# Altium project converter1.PrjPcb
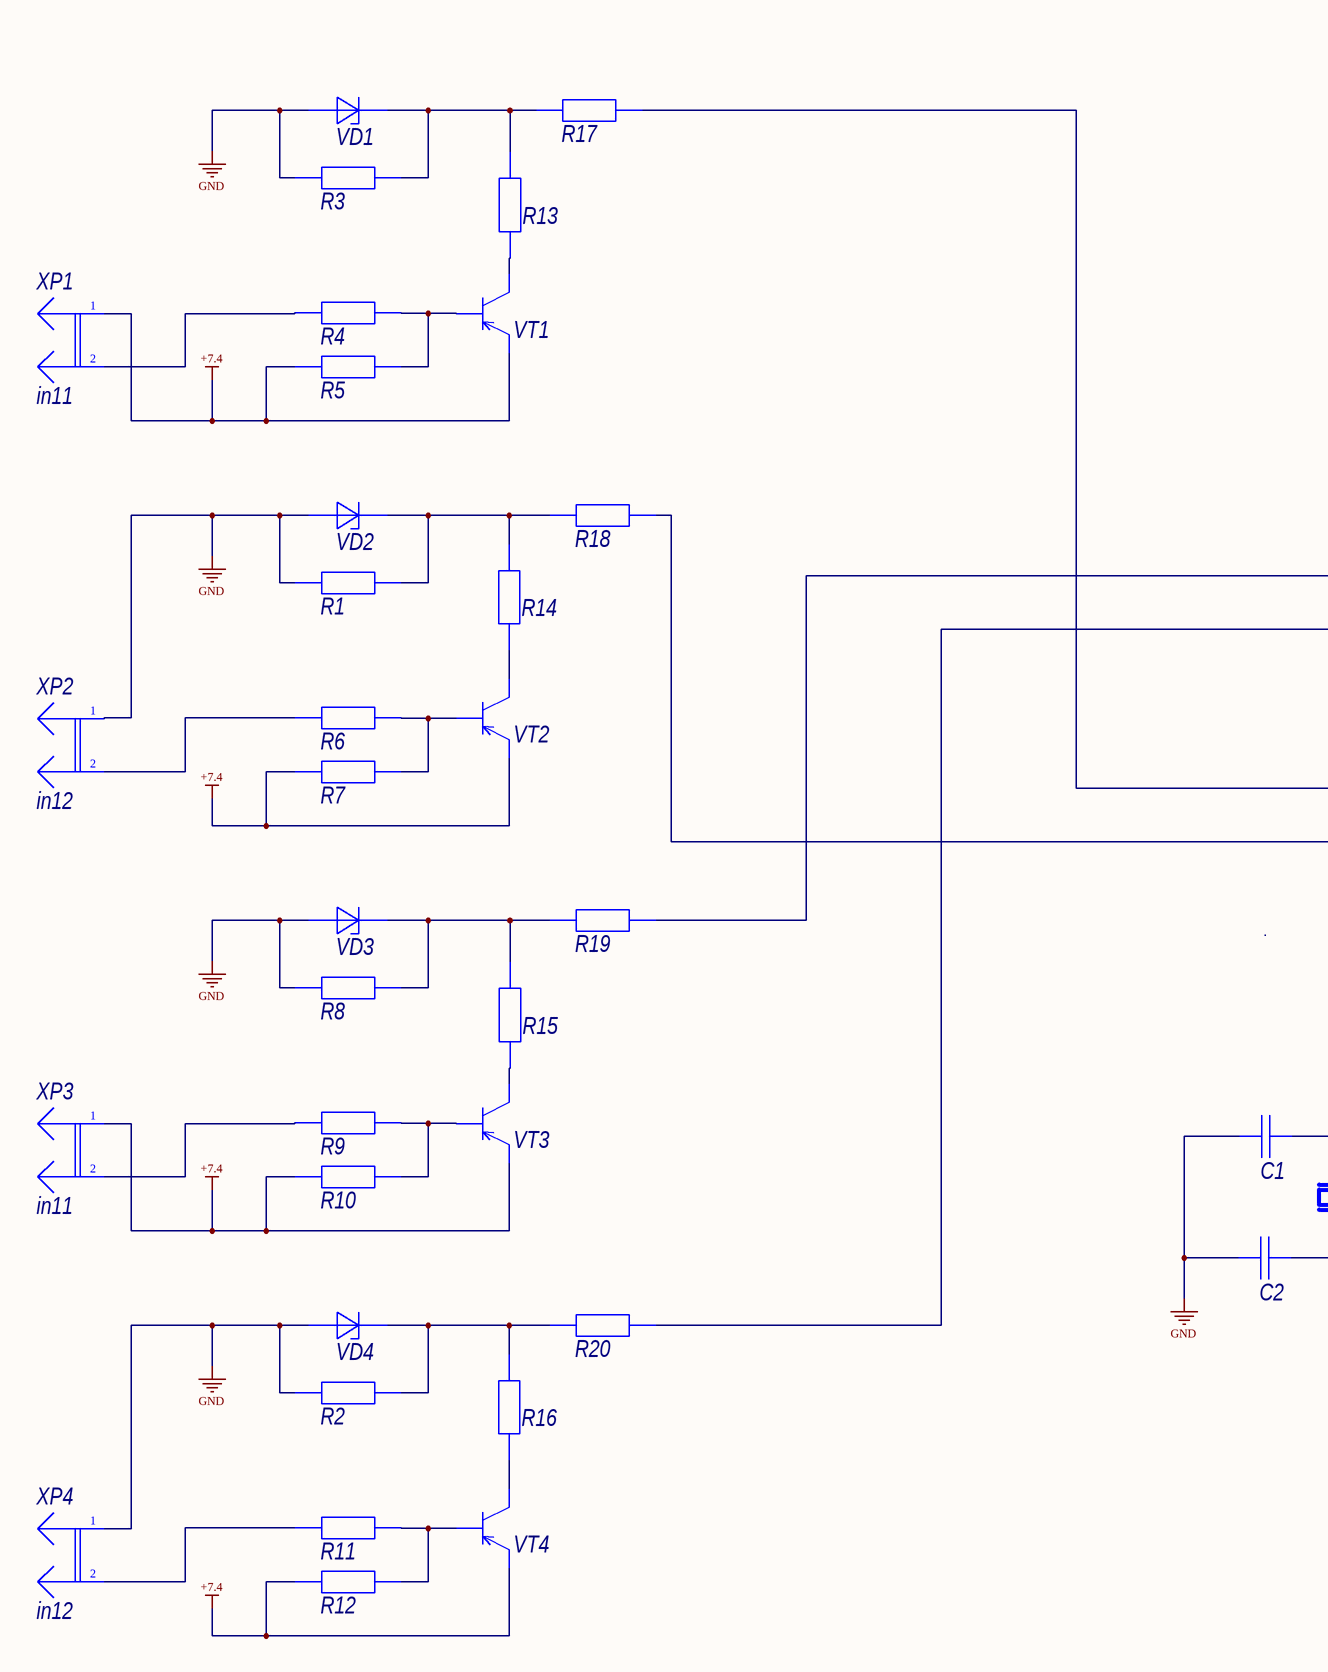
[diagram p0: Sheet1.SchDoc, left]
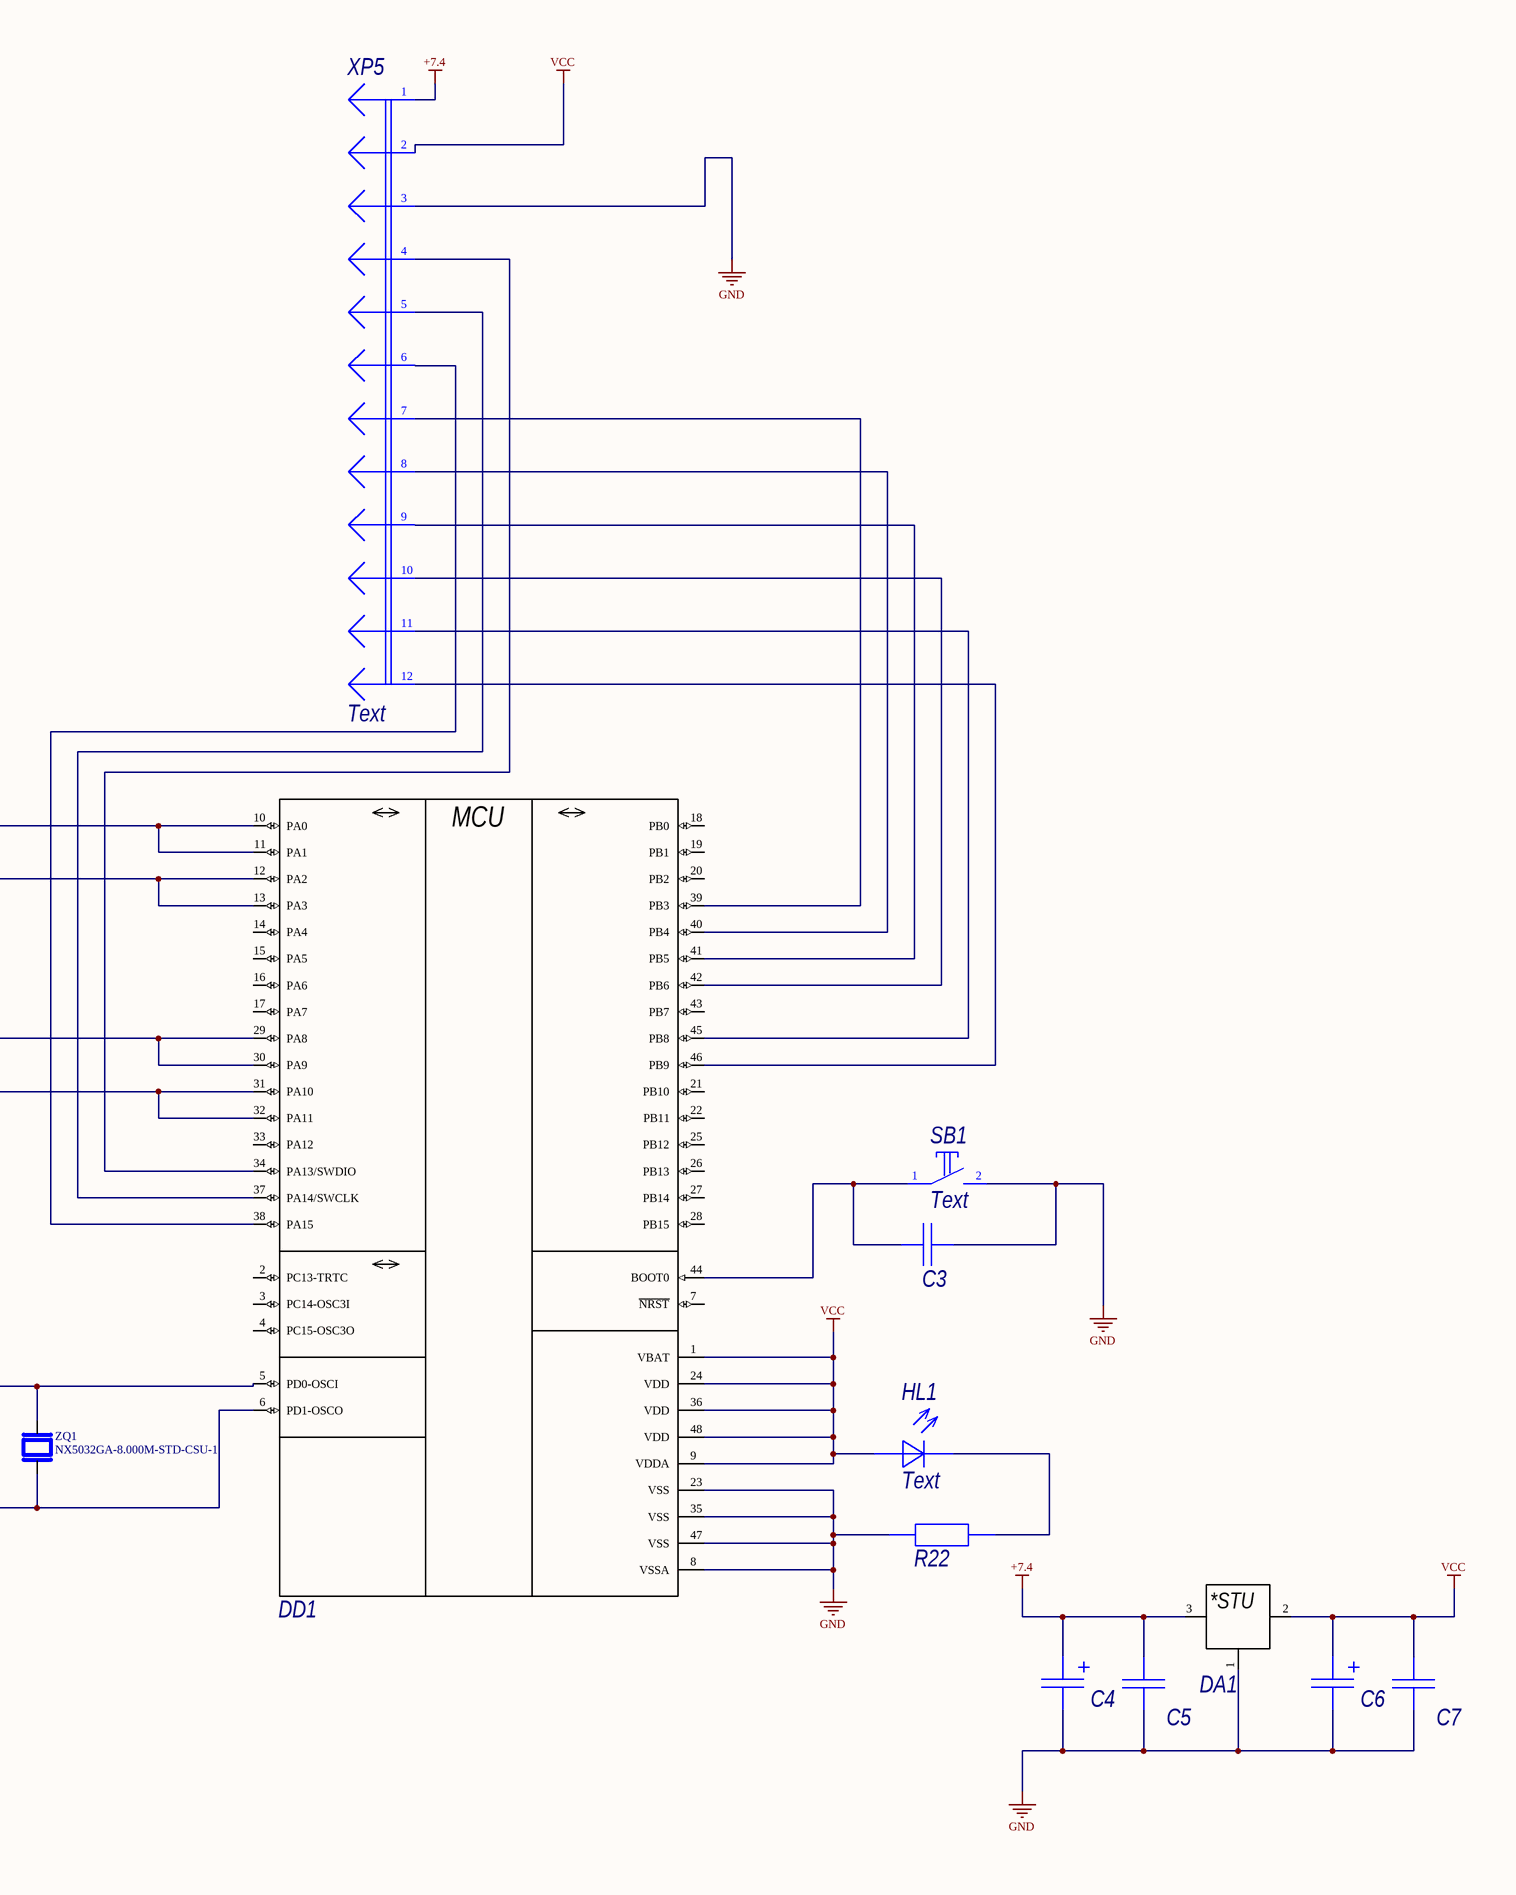
[diagram p1: Sheet1.SchDoc, right]
1 sheet, 46 parts. Net scope: global (net labels, ports and power ports of the same name join across sheets).
Board file: PCB1.PcbDoc

## Sheet Sheet1.SchDoc
size A2

### Parts
C1  Capacitor  [C0603]  (value not drawn)
C2  Capacitor  [C0603]  (value not drawn)
C3  Capacitor  [C0603]  (value not drawn)
C4  Capacitor-T  [C3216-p]  (value not drawn)
C5  Capacitor  [C0603]  (value not drawn)
C6  Capacitor-T  [C3216-p]  (value not drawn)
C7  Capacitor  [C0603]  (value not drawn)
DA1  LM1117-Series  [SOT-223]  (value not drawn)
DD1  STM32F103Cxxx-Series  [LQFP-48]  (value not drawn)
HL1  Text  [LD0805]
R1  Resistor  [R0603]  (value not drawn)
R2  Resistor  [R0603]  (value not drawn)
R3  Resistor  [R0603]  (value not drawn)
R4  Resistor  [R0603]  (value not drawn)
R5  Resistor  [R0603]  (value not drawn)
R6  Resistor  [R0603]  (value not drawn)
R7  Resistor  [R0603]  (value not drawn)
R8  Resistor  [R0603]  (value not drawn)
R9  Resistor  [R0603]  (value not drawn)
R10  Resistor  [R0603]  (value not drawn)
R11  Resistor  [R0603]  (value not drawn)
R12  Resistor  [R0603]  (value not drawn)
R13  Resistor  [R0603]  (value not drawn)
R14  Resistor  [R0603]  (value not drawn)
R15  Resistor  [R0603]  (value not drawn)
R16  Resistor  [R0603]  (value not drawn)
R17  Resistor  [R0603]  (value not drawn)
R18  Resistor  [R0603]  (value not drawn)
R19  Resistor  [R0603]  (value not drawn)
R20  Resistor  [R0603]  (value not drawn)
R22  Resistor  [R0603]  (value not drawn)
SB1  Text  [L-KLS7-TS3303A-1.5-250-B]
VD1  Zener  [SOT-23]  (value not drawn)
VD2  Zener  [SOT-23]  (value not drawn)
VD3  Zener  [SOT-23]  (value not drawn)
VD4  Zener  [SOT-23]  (value not drawn)
VT1  BJT-PNP  [SOT-23]  (value not drawn)
VT2  BJT-PNP  [SOT-23]  (value not drawn)
VT3  BJT-PNP  [SOT-23]  (value not drawn)
VT4  BJT-PNP  [SOT-23]  (value not drawn)
XP1  in11  [PLS-2]
XP2  in12  [PLS-2]
XP3  in11  [PLS-2]
XP4  in12  [PLS-2]
XP5  Text  [PLS-12]
ZQ1  NX5032GA-8.000M-STD-CSU-1  [XTAL_NX5032GA-8.000M-STD-CSU-1]

### Nets
+7.4: C4.1 C5.1 DA1.3(In) R5.1 R7.1 R10.1 R12.1 VT1.3(Э) VT2.3(Э) VT3.3(Э) VT4.3(Э) XP1.1 XP3.1 XP5.1
GND: C1.1 C2.1 C3.2 C4.2 C5.2 C6.2 C7.2 DA1.1(Adj/GND) DD1.8(VSSA) DD1.23(VSS) DD1.35(VSS) DD1.47(VSS) R1.1 R2.1 R3.1 R8.1 R22.1 SB1.2 VD1.1(А) VD2.1(А) VD3.1(А) VD4.1(А) XP2.1 XP4.1 XP5.3
VCC: C6.1 C7.1 DA1.2(Out) DD1.1(VBAT) DD1.9(VDDA) DD1.24(VDD) DD1.36(VDD) DD1.48(VDD) HL1.1(А) XP5.2
NetC1_2: C1.2 DD1.5(PD0-OSCI) ZQ1.2
NetC2_2: C2.2 DD1.6(PD1-OSCO) ZQ1.1
NetC3_1: C3.1 DD1.44(BOOT0) SB1.1
NetDD1_10: DD1.10(PA0) DD1.11(PA1) R19.1
NetDD1_12: DD1.12(PA2) DD1.13(PA3) R20.1
NetDD1_29: DD1.29(PA8) DD1.30(PA9) R17.1
NetDD1_31: DD1.31(PA10) DD1.32(PA11) R18.1
NetDD1_34: DD1.34(PA13/SWDIO) XP5.4
NetDD1_37: DD1.37(PA14/SWCLK) XP5.5
NetDD1_38: DD1.38(PA15) XP5.6
NetDD1_39: DD1.39(PB3) XP5.7
NetDD1_40: DD1.40(PB4) XP5.8
NetDD1_41: DD1.41(PB5) XP5.9
NetDD1_42: DD1.42(PB6) XP5.10
NetDD1_45: DD1.45(PB8) XP5.11
NetDD1_46: DD1.46(PB9) XP5.12
NetHL1_2: HL1.2(К) R22.2
NetR1_2: R1.2 R14.2 R18.2 VD2.2(К)
NetR2_2: R2.2 R16.2 R20.2 VD4.2(К)
NetR3_2: R3.2 R13.1 R17.2 VD1.2(К)
NetR4_1: R4.1 XP1.2
NetR4_2: R4.2 R5.2 VT1.1(Б)
NetR6_1: R6.1 XP2.2
NetR6_2: R6.2 R7.2 VT2.1(Б)
NetR8_2: R8.2 R15.1 R19.2 VD3.2(К)
NetR9_1: R9.1 XP3.2
NetR9_2: R9.2 R10.2 VT3.1(Б)
NetR11_1: R11.1 XP4.2
NetR11_2: R11.2 R12.2 VT4.1(Б)
NetR13_2: R13.2 VT1.2(К)
NetR14_1: R14.1 VT2.2(К)
NetR15_2: R15.2 VT3.2(К)
NetR16_1: R16.1 VT4.2(К)

Not connected (* = marked no-connect by the designer): DD1 2(PC13-TRTC) 3(PC14-OSC3I) 4(PC15-OSC3O) 7(~{NRST}) 14(PA4) 15(PA5) 16(PA6) 17(PA7) 18(PB0) 19(PB1) 20(PB2) 21(PB10) 22(PB11) 25(PB12) 26(PB13) 27(PB14) 28(PB15) 33(PA12) 43(PB7)

### Notes on the sheet
- (in symbol LM1117MPX-ADJ) *STU
- (in symbol STM32F103C8T6) MCU

### Library data of the parts
C1 C2 = GRM1885C1H300FA01D: 30pF 0603; Manufacturer: Murata; Type: Конденсатор; ID: 168; Voltage: 50V; Tolerance: ±1%; Dielectric Type: NP0; Application Category: 1; Published: 18.05.2010; Publisher: Andrew Danich; Part Number: GRM1885C1H300FA01D; Value: 30pF; Footprint: 0603
C3 C5 C7 = GRM188R71C104KA01D: 0.1 uF; Manufacturer: Murata; Type: Конденсатор; ID: 131; Value: 0.1uF; Voltage: 16V; Tolerance: ±10%; Dielectric Type: X7R; Application Category: 1; Working Temperature Min: -55°С; Working Temperature Max: +125°С; Published: 18.05.2010; Publisher: Andrew Danich; Part Number: GRM188R71C104KA01D; Footprint: 0603
C4 C6 = T491A106K006AT: 10 uF; Manufacturer: Kemet; Type: Конденсатор; ID: 25; Value: 10uF; Voltage: 6.3V; Tolerance: ±10%; ESR: 4ohm; Leakage Current: 600nA; Application Category: 1; Working Temperature Min: -55°С; Working Temperature Max: +125°С; Published: 23.04.2010; Publisher: Andrew Danich; Part Number: T491A106K006AT; Footprint: A
DA1 = LM1117MPX-ADJ: ID: 5; Input Voltage: +8.5…20V; Output Current: 800mA; Output Voltage: +ADJ; Published: 13.08.2015; Publisher: Andrew Danich; Type: Микросхема; Part Number: LM1117MPX-ADJ; Value: LM1117MPX-ADJ
DD1 = STM32F103C8T6: Manufacturer: STMicroelectronics; ID: 20; Supply Operation: +2.0…3.6V; Flash: 64K; SRAM: 20K; Prog Interface: JTAG, SWD, UART; I/O Lines: 37; Operation Frequency: 72MHz; Application Category: 1; Working Temperature Min: -40°С; Working Temperature Max: +85°С; Published: 16.10.2015; Publisher: Andrew Danich; Type: Микросхема; Part Number: STM32F103C8T6; Value: STM32F103C8T6; EEPROM: -
HL1 = KP-2012SGC: Manufacturer: Kingbright; Type: Индикатор единичный; ID: 21; Forward Voltage: 2.5V; Forward Current: 25mA; Power Dissipation: 62.5mW; Color: Green; Leds: 1; Working Temperature Min: -40°С; Working Temperature Max: +85°С; Published: 03.12.2013; Publisher: Andrew Danich; Part Number: KP-2012SGC; Value: KP-2012SGC; Footprint: 0805; Application Category: 1
R1-R4 R6-R9 R11 R12 = RC0603JR-0710KL: 10K; Manufacturer: Yageo; ID: 12; Limit Voltage: 50V; Tolerance: ±5%; Temperature Coefficient: 100ppm; Total Power Dissipation: 0.1W; Series Type: Thick-Film; Application Category: 1; Working Temperature Min: -55°С; Working Temperature Max: +155°С; Functional Analog: CR0603-JW-103E; Published: 24.03.2010; Publisher: Andrew Danich; Type: Резистор; Part Number: RC0603JR-0710KL; Value: 10k; Footprint: 0603
R5 R10 = RC0603JR-07100KL: 100k; Manufacturer: Yageo; ID: 11; Limit Voltage: 50V; Tolerance: ±5%; Temperature Coefficient: 100ppm; Total Power Dissipation: 0.1W; Series Type: Thick-Film; Application Category: 1; Working Temperature Min: -55°С; Working Temperature Max: +155°С; Functional Analog: CR0603-JW-104E; Published: 24.03.2010; Publisher: Andrew Danich; Type: Резистор; Part Number: RC0603JR-07100KL; Value: 100k; Footprint: 0603
R13-R20 = RC0603JR-071KL: 1k; Manufacturer: Yageo; ID: 19; Limit Voltage: 50V; Tolerance: ±5%; Temperature Coefficient: 100ppm; Total Power Dissipation: 0.1W; Series Type: Thick-Film; Application Category: 1; Working Temperature Min: -55°С; Working Temperature Max: +155°С; Functional Analog: CR0603-JW-102E; Published: 24.03.2010; Publisher: Andrew Danich; Type: Резистор; Part Number: RC0603JR-071KL; Value: 1k; Footprint: 0603
R22 = RC0603FR-07200KL: 68 Om; Manufacturer: Yageo; ID: 348; Value: 200k; Limit Voltage: 50V; Tolerance: ±1%; Temperature Coefficient: 100ppm; Total Power Dissipation: 0.1W; Series Type: Thick-Film; Application Category: 1; Working Temperature Min: -55°С; Working Temperature Max: +155°С; Published: 24.03.2010; Publisher: Andrew Danich; Type: Резистор; Part Number: RC0603FR-07200KL; Footprint: 0603
SB1 = L-KLS7-TS3303A-1.5-250-B: ID: 31; Published: 17.04.2014; Publisher: Andrew Danich; Type: Переключатель; Part Number: L-KLS7-TS3303A-1.5-250-B
VD1-VD4 = BZX84-C3V3: Manufacturer: NXP; Type: Стабилитрон; ID: 10; Working Voltage: 3.3V; Reverse Current: 5uA; Forward Voltage: 0.9V; Forward Current: 200mA; Total Power Dissipation: 250mW; Capacitance: 450pF; Differential resistance: 95ohm; Application Category: 1; Working Temperature Min: -65°С; Working Temperature Max: +150°С; Published: 20.05.2013; Publisher: Andrew Danich; Part Number: BZX84-C3V3; Value: BZX84-C3V3
VT1-VT4 = BC857: Part Number: BC857; Type: Транзистор; ID: 2; Value: BC857; C-E Voltage: 45V; Collector Current: 100mA; C-E Saturation Voltage: 0.6V; DC Current Gain: 125…800; Total Power Dissipation: 250mW; Transition Frequency: 100MHz; Published: 07.05.2013; Publisher: Andrew Danich
XP1-XP4 = PLS-2: Value: PLS-2; ID: 1; Limit Voltage: 250V; Limit Current: 3A; Connector Type: Male; Resistance: 15momh; Surface Finish: Gold; Pitch: 2.54mm; Published: 07.03.2013; Publisher: Andrew Danich; Type: Вилка; Part Number: PLS-2; Pins: 2
XP5 = PLS-12: Value: PLS-12; ID: 10; Limit Voltage: 250V; Limit Current: 3A; Connector Type: Male; Resistance: 15momh; Surface Finish: Gold; Pitch: 2.54mm; Published: 07.03.2013; Publisher: Andrew Danich; Type: Вилка; Part Number: PLS-12; Pins: 12
ZQ1 = NX5032GA-8.000M-STD-CSU-1: 8 MHz ±50ppm Crystal 8pF 300 Ohms 2-SMD, No Lead; MF: NDK America,; SnapEDA_Link: https://www.snapeda.com/parts/NX5032GA-8.000M-STD-CSU-1/NDK+America%252C+Inc./view-part/?ref=snap; Package: SMD-2 NDK America, Inc.; Value: *; MP: NX5032GA-8.000M-STD-CSU-1; Check_prices: https://www.snapeda.com/parts/NX5032GA-8.000M-STD-CSU-1/NDK+America%252C+Inc./view-part/?ref=eda